# Altium schematic sheet MINI-STM32.SchDoc
size A3
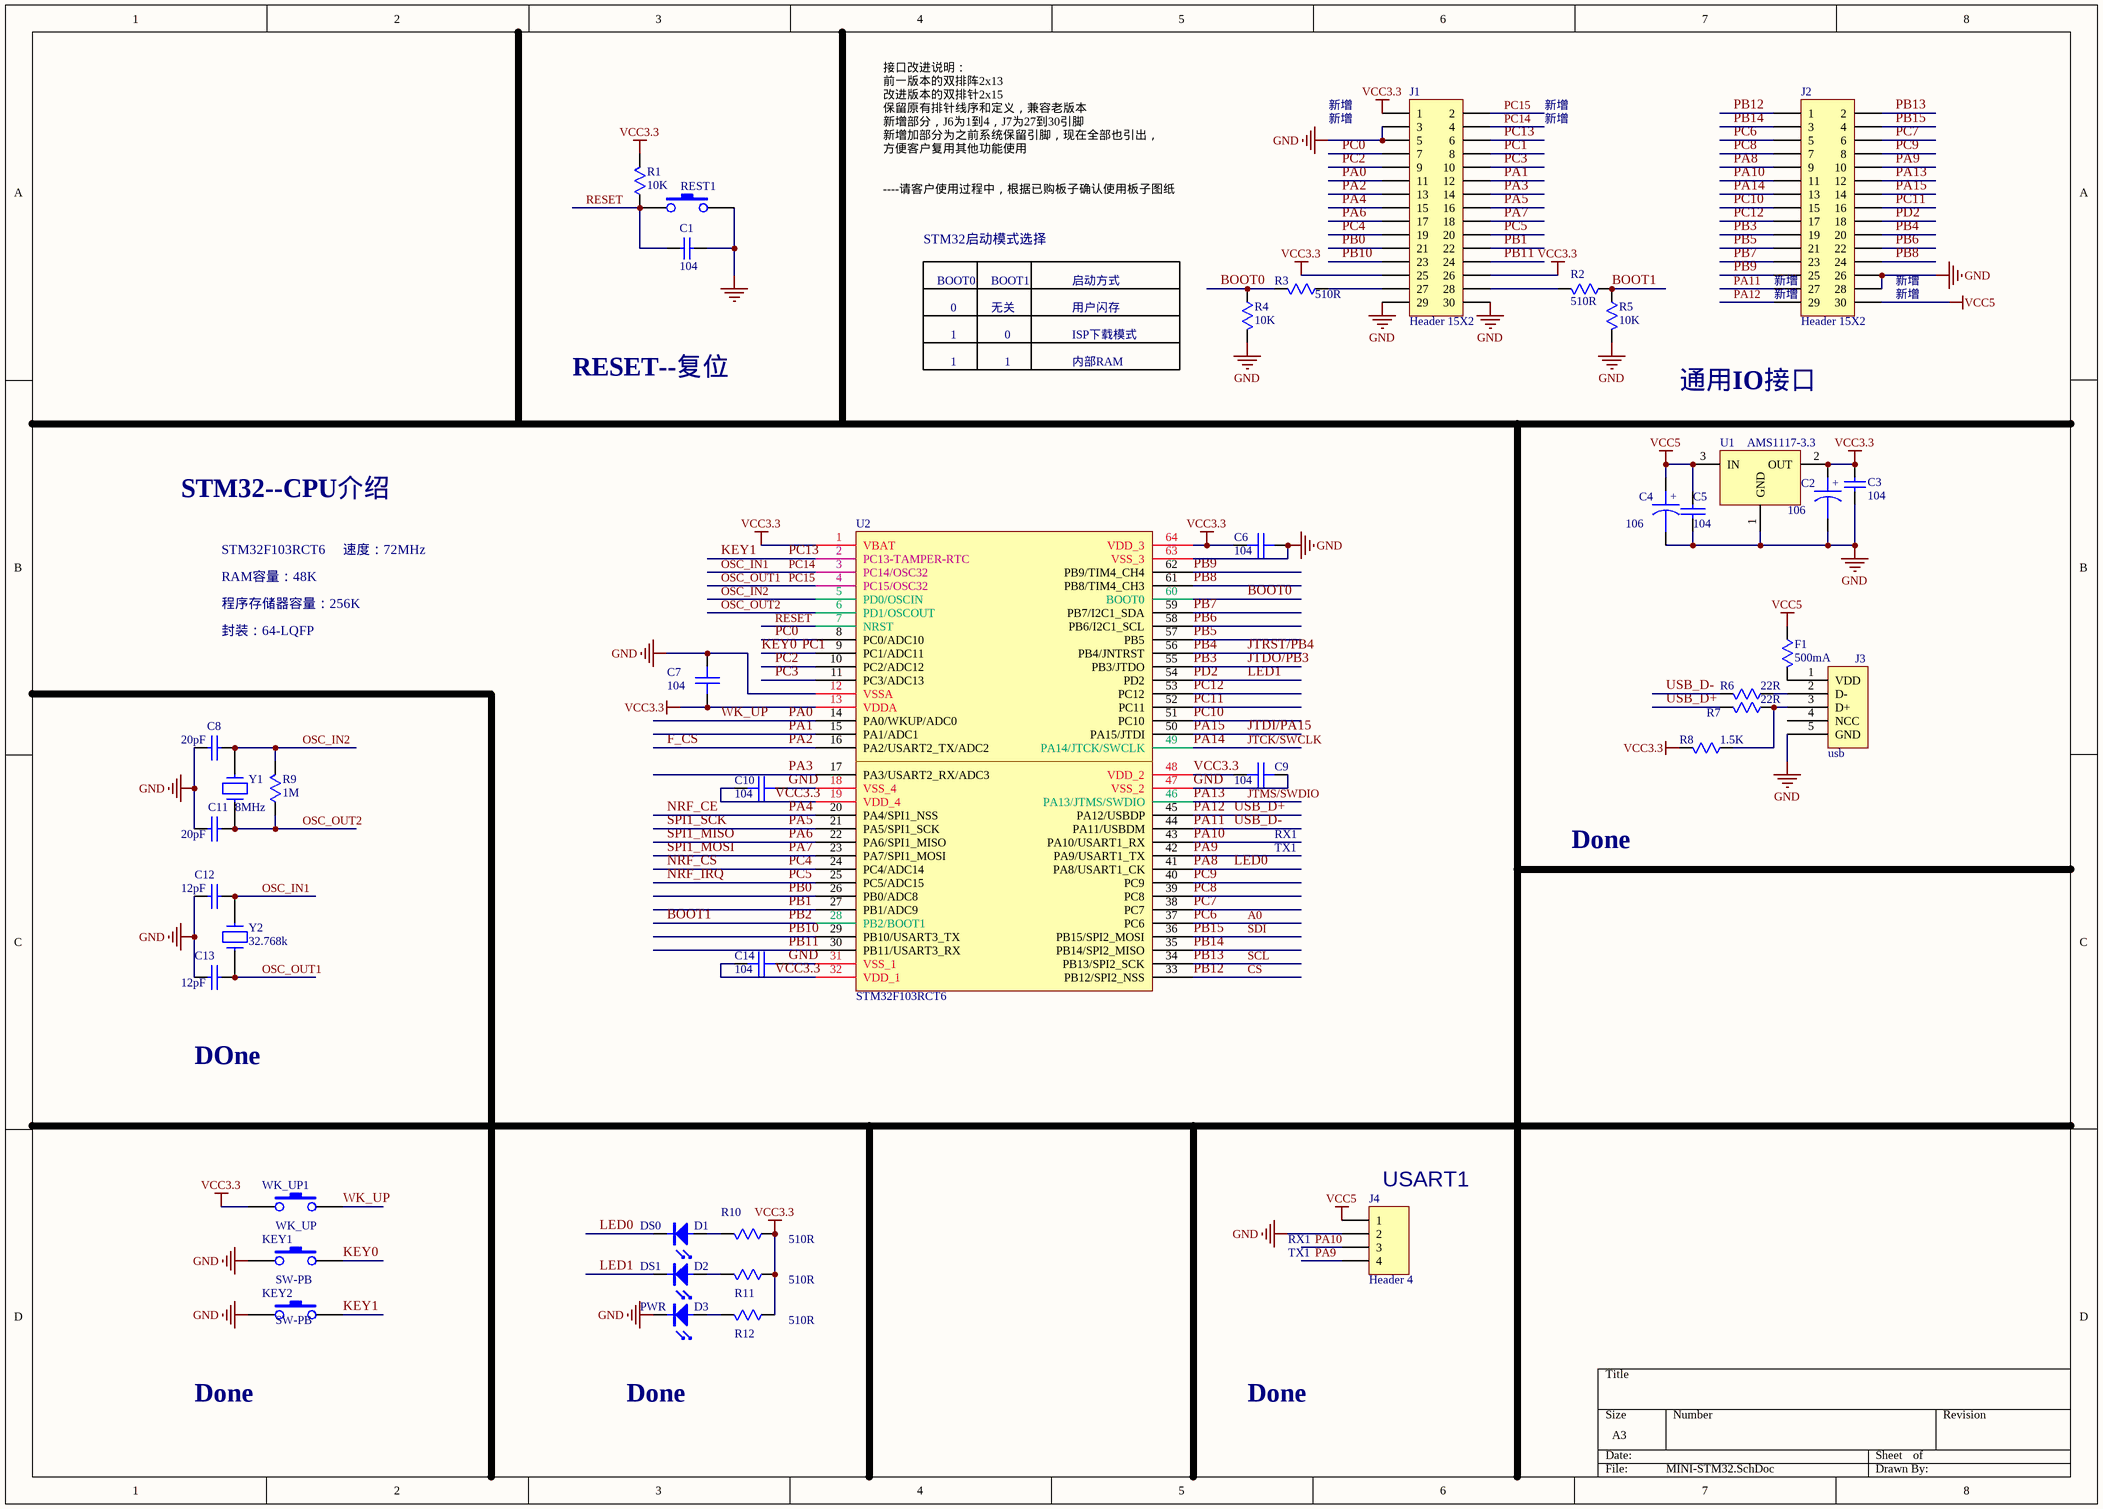
[diagram p0: MINI-STM32.SchDoc]

## Parts
C1  104  [0603C]
C2  106  [RC0805]
C3  104  [0603J]
C4  106  [RC0805]
C5  104  [0603J]
C6  104  [0603J]
C7  104  [0603J]
C8  20pF  [0603J]
C9  104  [0603J]
C10  104  [0603J]
C11  20pF  [0603J]
C12  12pF  [0603J]
C13  12pF  [0603J]
C14  104  [0603J]
D1  DS0  [LED0805]
D2  DS1  [LED0805]
D3  PWR  [LED0805]
F1  500mA  [RC0805]
J1  Header 15X2  [IDE15X2_2.54]
J2  Header 15X2  [IDE15X2_2.54]
J3  usb  [mini_USB]
J4  Header 4  [HDR1X4]
KEY1  SW-PB  [SW-SPST]
KEY2  SW-PB  [SW-SPST]
R1  10K  [0603J]
R2  510R  [0603J]
R3  510R  [0603J]
R4  10K  [0603J]
R5  10K  [0603J]
R6  22R  [0603J]
R7  22R  [0603J]
R8  1.5K  [0603J]
R9  1M  [0603J]
R10  510R  [0603J]
R11  510R  [0603J]
R12  510R  [0603J]
REST1  (no value)  [SW-SPST]
U1  AMS1117-3.3  [SOT223]
U2  STM32F103RCT6  [LQFP64]
WK_UP1  WK_UP  [SW-SPST]
Y1  8MHz  [smt-xtal]
Y2  32.768k  [32.768k]

## Nets
GND: C1.1 C2.2 C3.2 C4.2 C5.2 C6.2 C7.1 C8.1 C9.2 C10.2 C11.1 C12.1 C13.1 C14.2 D3.2 J1.3 J1.5 J1.29 J1.30 J2.26 J2.28 J3.5(GND) J4.2 KEY1.1 KEY2.1 R4.2 R5.2 REST1.2 U1.1(GND) U2.12(VSSA) U2.18(VSS_4) U2.31(VSS_1) U2.47(VSS_2) U2.63(VSS_3)
VCC3.3: C2.1 C3.1 C6.1 C7.2 C9.1 C10.1 C14.1 J1.1 J1.25 J1.26 R1.2 R8.2 R10.1 R11.1 R12.1 U1.2(OUT) U2.1(VBAT) U2.13(VDDA) U2.19(VDD_4) U2.32(VDD_1) U2.48(VDD_2) U2.64(VDD_3) WK_UP1.1
VCC5: C4.1 C5.1 F1.1 J2.30 J4.1 U1.3(IN)
A0: J2.5 U2.37(PC6)  [also labelled PC6]
BOOT0: R3.2 R4.1 U2.60(BOOT0)
BOOT1: R2.1 R5.1 U2.28(PB2/BOOT1)  [also labelled PB2]
CS: J2.1 U2.33(PB12/SPI2_NSS)  [also labelled PB12]
F_CS: J1.13 U2.16(PA2/USART2_TX/ADC2)  [also labelled PA2]
JTCK/SWCLK: J2.13 U2.49(PA14/JTCK/SWCLK)  [also labelled PA14]
JTDI/PA15: J2.14 U2.50(PA15/JTDI)  [also labelled PA15]
JTDO/PB3: J2.19 U2.55(PB3/JTDO)  [also labelled PB3]
JTMS/SWDIO: J2.12 U2.46(PA13/JTMS/SWDIO)  [also labelled PA13]
JTRST/PB4: J2.20 U2.56(PB4/JNTRST)  [also labelled PB4]
KEY0: J1.8 KEY1.2 U2.9(PC1/ADC11)  [also labelled PC1]
KEY1: J1.6 KEY2.2 U2.2(PC13-TAMPER-RTC)  [also labelled PC13]
LED0: D1.2 J2.9 U2.41(PA8/USART1_CK)  [also labelled PA8]
LED1: D2.2 J2.18 U2.54(PD2)  [also labelled PD2]
NRF_CE: J1.15 U2.20(PA4/SPI1_NSS)  [also labelled PA4]
NRF_CS: J1.19 U2.24(PC4/ADC14)  [also labelled PC4]
NRF_IRQ: J1.20 U2.25(PC5/ADC15)  [also labelled PC5]
OSC_IN1: C12.2 J1.4 U2.3(PC14/OSC32) Y2.2  [also labelled PC14]
OSC_IN2: C8.2 R9.2 U2.5(PD0/OSCIN) Y1.1
OSC_OUT1: C13.2 J1.2 U2.4(PC15/OSC32) Y2.1  [also labelled PC15]
OSC_OUT2: C11.2 R9.1 U2.6(PD1/OSCOUT) Y1.2
PA0: J1.11 U2.14(PA0/WKUP/ADC0) WK_UP1.2  [also labelled WK_UP]
PA1: J1.12 U2.15(PA1/ADC1)
PA3: J1.14 U2.17(PA3/USART2_RX/ADC3)
PA5: J1.16 U2.21(PA5/SPI1_SCK)  [also labelled SPI1_SCK]
PA6: J1.17 U2.22(PA6/SPI1_MISO)  [also labelled SPI1_MISO]
PA7: J1.18 U2.23(PA7/SPI1_MOSI)  [also labelled SPI1_MOSI]
PA9: J2.10 J4.4 U2.42(PA9/USART1_TX)
PA10: J2.11 J4.3 U2.43(PA10/USART1_RX)
PA11: J2.27 R6.2 U2.44(PA11/USBDM)  [also labelled USB_D-]
PA12: J2.29 R7.2 U2.45(PA12/USBDP)  [also labelled USB_D+]
PB0: J1.21 U2.26(PB0/ADC8)
PB1: J1.22 U2.27(PB1/ADC9)
PB5: J2.21 U2.57(PB5)
PB6: J2.22 U2.58(PB6/I2C1_SCL)
PB7: J2.23 U2.59(PB7/I2C1_SDA)
PB8: J2.24 U2.61(PB8/TIM4_CH3)
PB9: J2.25 U2.62(PB9/TIM4_CH4)
PB10: J1.23 U2.29(PB10/USART3_TX)
PB11: J1.24 U2.30(PB11/USART3_RX)
PB13: J2.2 U2.34(PB13/SPI2_SCK)  [also labelled SCL]
PB14: J2.3 U2.35(PB14/SPI2_MISO)
PB15: J2.4 U2.36(PB15/SPI2_MOSI)  [also labelled SDI]
PC0: J1.7 U2.8(PC0/ADC10)
PC2: J1.9 U2.10(PC2/ADC12)
PC3: J1.10 U2.11(PC3/ADC13)
PC7: J2.6 U2.38(PC7)
PC8: J2.7 U2.39(PC8)
PC9: J2.8 U2.40(PC9)
PC10: J2.15 U2.51(PC10)
PC11: J2.16 U2.52(PC11)
PC12: J2.17 U2.53(PC12)
RESET: C1.2 R1.1 REST1.1 U2.7(NRST)
NetD1_1: D1.1 R10.2
NetD2_1: D2.1 R11.2
NetD3_1: D3.1 R12.2
NetF1_2: F1.2 J3.1(VDD)
NetJ1_27: J1.27 R3.1
NetJ1_28: J1.28 R2.2
NetJ3_2: J3.2(D-) R6.1
NetJ3_3: J3.3(D+) R7.1 R8.1

Not connected (* = marked no-connect by the designer): J3 4(NCC)

## Notes on the sheet
- 新增
- 接口改进说明：
  前一版本的双排阵2x13
  改进版本的双排针2x15
  保留原有排针线序和定义，兼容老版本
  新增部分，J6为1到4，J7为27到30引脚
  新增加部分为之前系统保留引脚，现在全部也引出，
  方便客户复用其他功能使用
  ----请客户使用过程中，根据已购板子确认使用板子图纸
- STM32启动模式选择
- BOOT0
- 0
- BOOT1
- 无关
- 启动方式
- 用户闪存
- (near J2) 新增
- RESET--复位
- 1
- ISP下载模式
- 内部RAM
- 通用IO接口
- STM32--CPU介绍
- STM32F103RCT6
- RAM容量：48K
- 速度：72MHz
- 程序存储器容量：256K
- 封装：64-LQFP
- RX1
- TX1
- Done
- DOne
- (near J4) USART1
- (in symbol CAPACITOR POL) +

## Library data of the parts
C1 = CAP: GRM39 X7R102K50PT; Value: 100pF; Published: 8-Jun-2000; Revision: July-2002: Re-released for DXP Platform.; Publisher: Altium Limited; REF: GRM39 X7R102K50PT
C2 C4 = CAPACITOR POL: Capacitor
C3 = Cap: Capacitor; Published: 8-Jun-2000; LatestRevisionDate: 17-Jul-2002; LatestRevisionNote: Re-released for DXP Platform.; PackageReference: RAD-0.3; Publisher: Altium Limited
C5 = CAP: Capacitor
C6 C7 C9 C10 C14 = CAP
C8 C11 = CAP: CAP CHIP 20P 50V(+-5% C0G 0603); Value: 20pF
C12 C13 = CAP: CAP CHIP 20P 50V(+-5% C0G 0603); Value: 20pF
D1-D3 = LED
F1 R1-R12 = RES
J1 J2 = Header 15X2: Header, 15-Pin, Dual row; LatestRevisionDate: 17-Jul-2002; LatestRevisionNote: Re-released for DXP Platform.; Publisher: Altium Limited
J4 = Header 4: Header, 4-Pin; LatestRevisionDate: 17-Jul-2002; LatestRevisionNote: Re-released for DXP Platform.; Publisher: Altium Limited
REST1 WK_UP1 = SW-PB
U1 = LT1085CM-3.3
U2 = STM32F103RBT6
Y1 Y2 = CRYSTAL: Crystal 8MHz PLUG; Value: 8MHz